# EAGLE design ball_catch_unit_front (EAGLE 9.6.2)
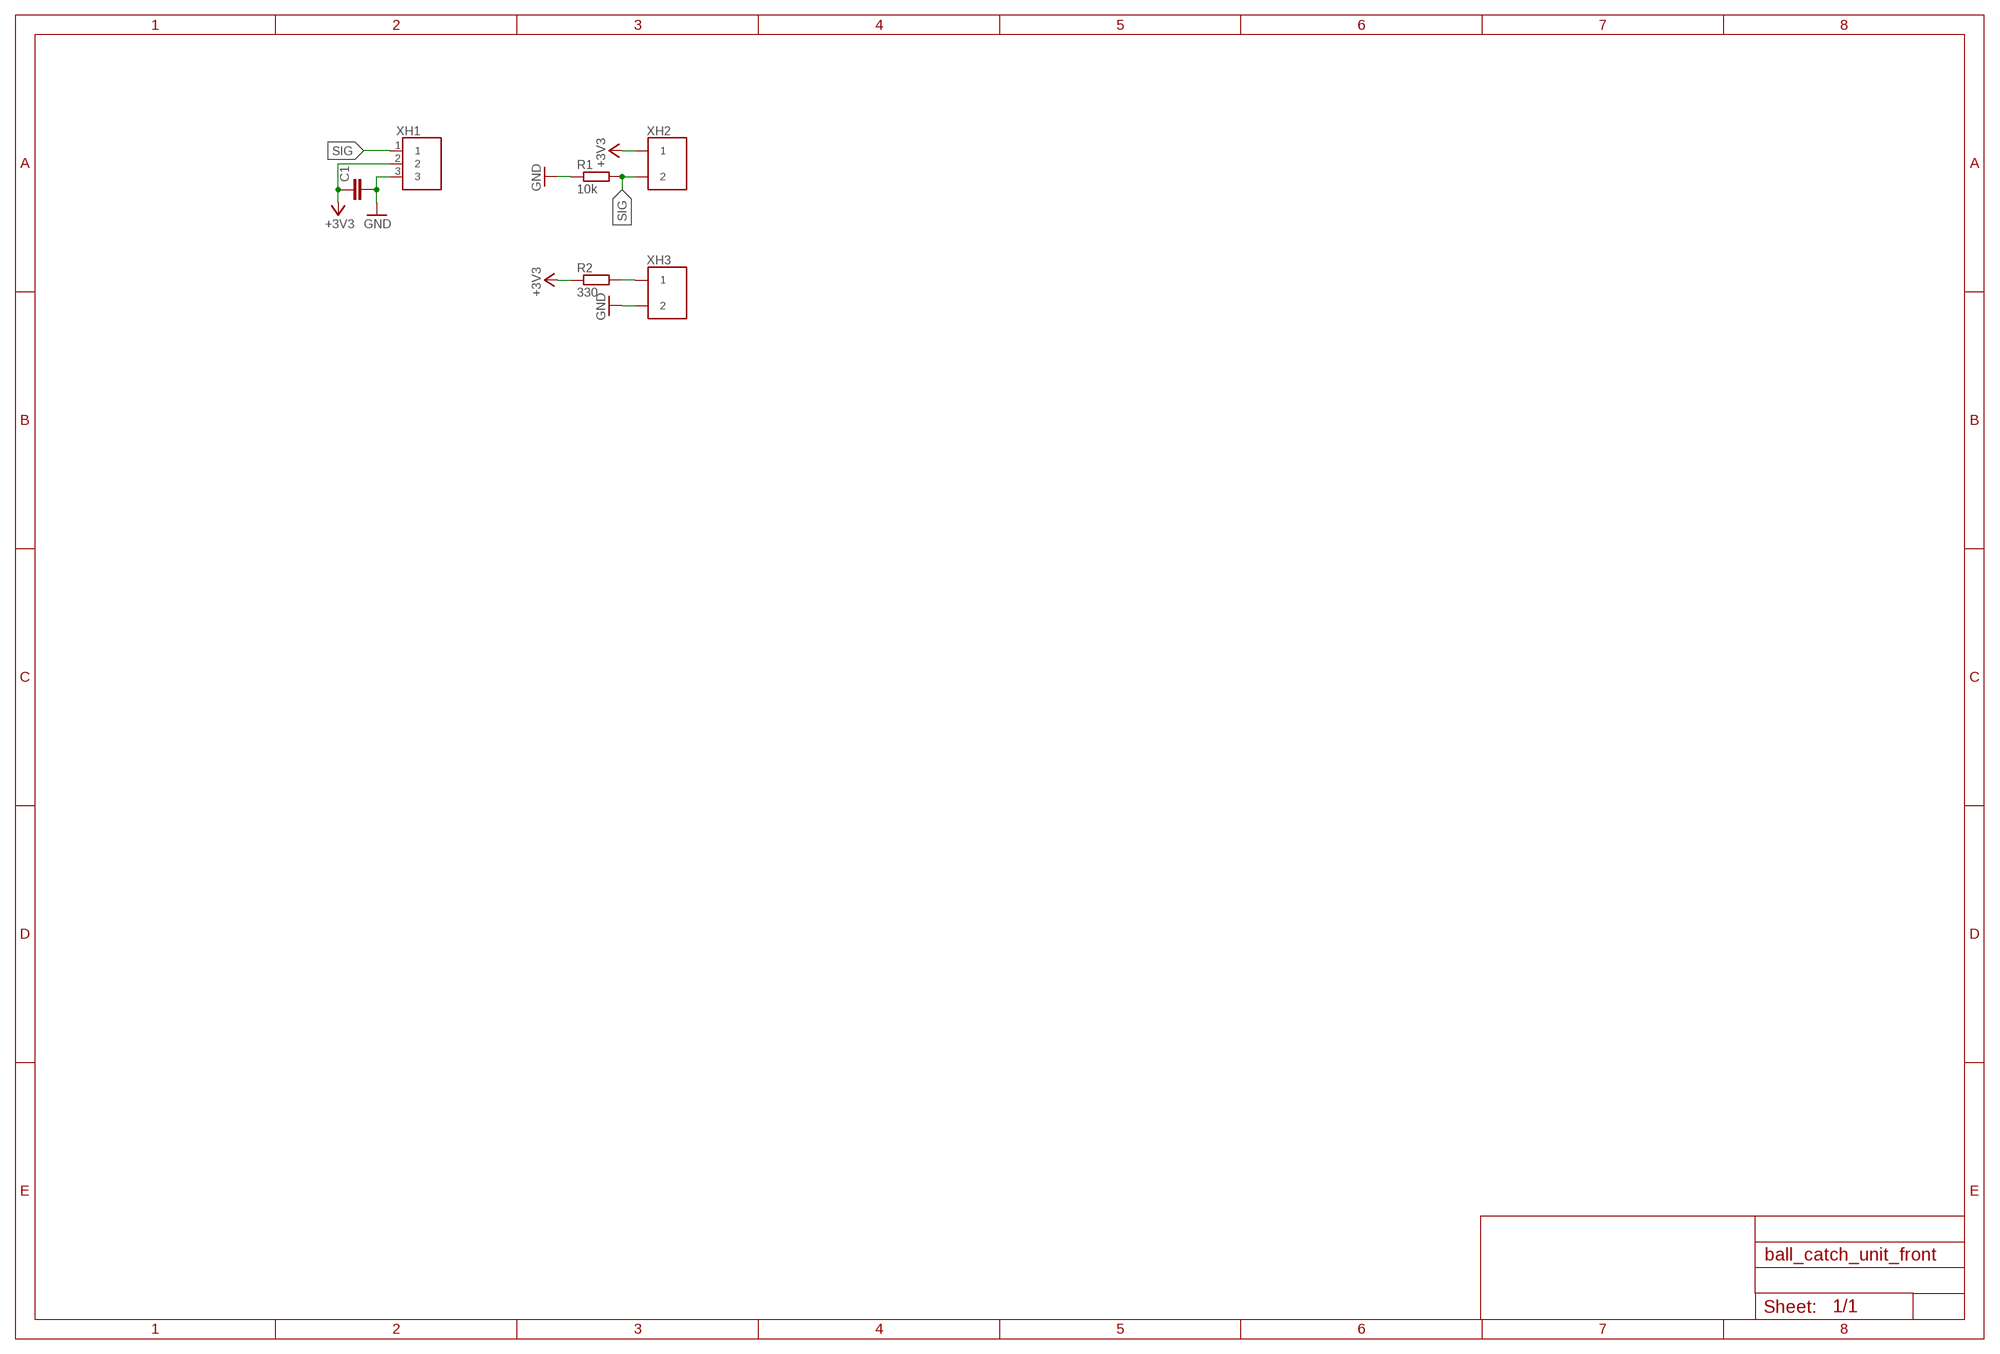
[diagram p0: schematic, sheet 1]

## Parts
C1  C-EUC0603  [C0603]
R1  10k  R-EU_0204/7  [0204/7]
R2  330  R-EU_0204/7  [0204/7]
XH1  S3B  [S3B]
XH2  2B  [2B]
XH3  S2B  [S2B]

## Nets
+3V3: C1.1 R2.1 XH1.2 XH2.1
GND: C1.2 R1.1 XH1.3 XH3.2
N$1: R2.2 XH3.1
SIG: R1.2 XH1.1 XH2.2

## Library data of the parts
C1 = rcl:C-EU: CAPACITOR, European symbol; SPICEPREFIX: C
R1 R2 = rcl:R-EU_: RESISTOR, European symbol; SPICEPREFIX: R
XH1 = XH:S3B
XH2 = XH:2B
XH3 = XH:S2B

## Board
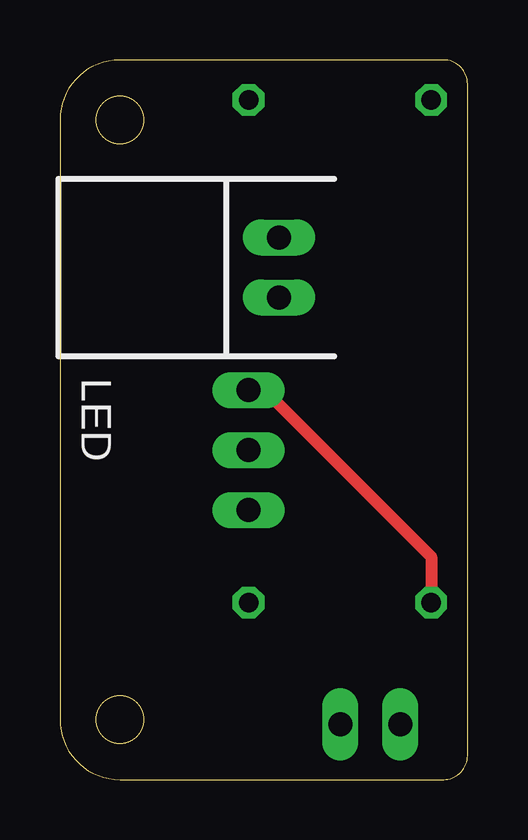
[diagram p1: board, top side]
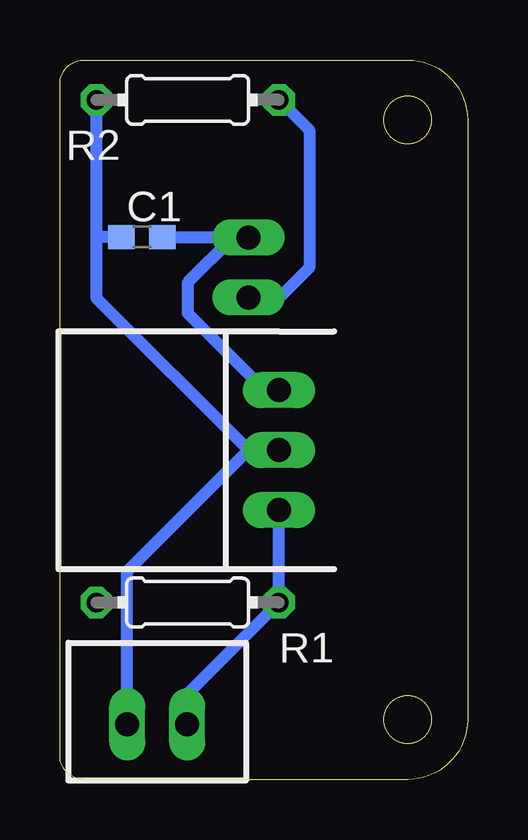
[diagram p2: board, bottom side, seen from below]

Size 17 x 30 mm. Coordinates in mm from the lower left corner, seen from the top.
Outline: 16,0 arc90 17,1 17,29 arc90 16,30 2.5,30 arc90 0,27.5 0,2.5 arc90 2.5,0 16,0
Outline: circle at 2.5,2.5 radius 1
Outline: circle at 2.5,27.5 radius 1
Copper layers (1*16): Top 0.035mm / dielectric 1.5mm / Bottom 0.035mm
Design rules "default *": minimum track width 6mil, minimum drill 0.35mm, track to track 6mil, track to pad 6mil, pad to pad 6mil, via to via 6mil, smd to smd 6mil, copper to edge 30mil, drill to drill 6mil, minimum pad ring 10mil, minimum via ring 8mil, stop-mask expansion 4mil, vias tented up to drill 0mil, thermal gap 10mil

### Footprints (pad centres in the part's own frame; a part is rotated, then mirrored left to right if it is on the bottom)
C0603 = smd 1.1 x 1: 1 -0.85,0; 2 0.85,0
0204/7 = drill 0.813 octagon: 1 -3.81,0; 2 3.81,0
S3B = drill 1 long: 1 0,2.5; 2 0,0; 3 0,-2.5
2B = drill 1 long: 1 0,1.25; 2 0,-1.25
S2B = drill 1 long: 1 0,1.25; 2 0,-1.25

### Placement (x,y rotation side)
C1  13.58,22.62 0 bottom
R1  11.68,7.38 0 bottom
R2  11.68,28.34 0 bottom
XH1  7.87,13.73 180 bottom
XH2  12.95,2.3 90 bottom
XH3  9.13,21.35 180 top

### Tracks (layer width: path | path; a pad name or v marks a point on that pad's centre or on a via)
+3V3
  Bottom 0.5: R2.1 15.48,22.62 | 15.48,22.62 15.48,20.08 9.13,13.73 | 9.13,13.73 XH1.2 | XH2.1 14.2,8.67 9.13,13.73 | C1.1 15.48,22.62
GND
  Top 0.5: XH1.3 8.54,16.23 15.48,9.29 R1.1
  Bottom 0.5: XH1.3 8.46,16.23 11.68,19.45 11.68,20.71 9.79,22.6 XH3.2 12.71,22.6 C1.2
N$1
  Bottom 0.5: R2.2 6.59,27.06 6.59,21.35 7.87,20.08 9.12,20.08 XH3.1
SIG
  Bottom 0.5: XH2.2 11.7,3.55 R1.2 XH1.1

### Text on the board
tPlace: LED